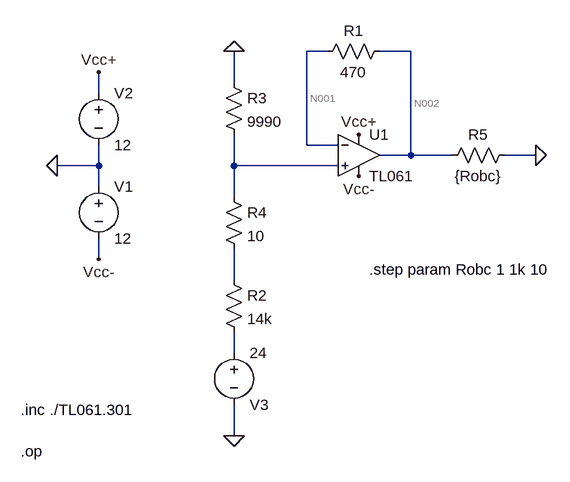
[diagram p0: schematic modul_10U_R.asc]
modul_10U_R.asc, the LTspice schematic file:
Version 4
SHEET 1 892 680
WIRE 528 -192 496 -192
WIRE 656 -192 608 -192
WIRE 384 -144 384 -192
WIRE 176 -128 176 -160
WIRE 496 -48 496 -192
WIRE 544 -48 496 -48
WIRE 656 -32 656 -192
WIRE 656 -32 608 -32
WIRE 720 -32 656 -32
WIRE 848 -32 800 -32
WIRE 176 -16 176 -48
WIRE 176 -16 112 -16
WIRE 384 -16 384 -64
WIRE 544 -16 384 -16
WIRE 176 16 176 -16
WIRE 384 32 384 -16
WIRE 176 128 176 96
WIRE 384 160 384 112
WIRE 384 272 384 240
WIRE 384 400 384 352
FLAG 112 -16 0
FLAG 176 -160 Vcc+
FLAG 176 128 Vcc-
FLAG 384 400 0
FLAG 576 -64 Vcc+
FLAG 576 0 Vcc-
FLAG 384 -192 0
FLAG 848 -32 0
SYMBOL voltage 176 0 R0
WINDOW 123 0 0 Left 0
WINDOW 39 0 0 Left 0
SYMATTR InstName V1
SYMATTR Value 12
SYMBOL voltage 176 -144 R0
WINDOW 123 0 0 Left 0
WINDOW 39 0 0 Left 0
SYMATTR InstName V2
SYMATTR Value 12
SYMBOL OpAmps\\opamp2 576 -96 R0
SYMATTR InstName U1
SYMATTR Value TL061
SYMBOL voltage 384 256 R0
WINDOW 0 24 96 Left 2
WINDOW 3 24 16 Left 2
WINDOW 123 0 0 Left 0
WINDOW 39 0 0 Left 0
SYMATTR InstName V3
SYMATTR Value 24
SYMBOL res 624 -208 R90
WINDOW 0 0 56 VBottom 2
WINDOW 3 32 56 VTop 2
SYMATTR InstName R1
SYMATTR Value 470
SYMBOL res 368 144 R0
SYMATTR InstName R2
SYMATTR Value 14k
SYMBOL res 368 -160 R0
SYMATTR InstName R3
SYMATTR Value 9990
SYMBOL res 368 16 R0
SYMATTR InstName R4
SYMATTR Value 10
SYMBOL res 816 -48 R90
WINDOW 0 0 56 VBottom 2
WINDOW 3 32 56 VTop 2
SYMATTR InstName R5
SYMATTR Value {Robc}
TEXT 56 360 Left 2 !.inc ./TL061.301
TEXT 592 144 Left 2 !.step param Robc 1 1k 10
TEXT 56 424 Left 2 !.op

The netlist it stands for:
* modul_10U_R.asc
V1 0 Vcc- 12
V2 Vcc+ 0 12
XU1 N003 N001 Vcc+ Vcc- N002 TL061  ; pins In+ In- V+ V- OUT
V3 N005 0 24
R1 N002 N001 470
R2 N004 N005 14k
R3 0 N003 9990
R4 N003 N004 10
R5 0 N002 {Robc}
.inc ./TL061.301
.step param Robc 1 1k 10
.op
.backanno
.end

* Results of the author's LTspice run, read from the files saved beside the schematic
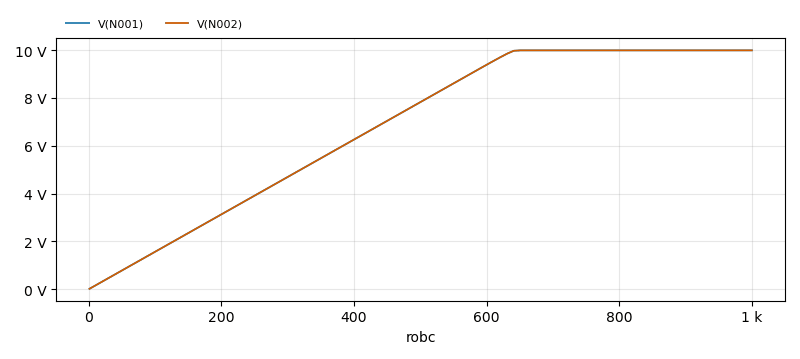
[diagram p1: Operating Point of modul_10U_R.asc, plotted from the saved traces]
* Operating Point, 1 run:
*   V(N001): 15.65 mV at robc=1 , 9.988 V at robc=1 k, min 15.65 mV, max 9.988 V
*   V(N002): 15.65 mV at robc=1 , 9.988 V at robc=1 k, min 15.65 mV, max 9.988 V
* From the log:
*   Semiconductor Device Operating Points:
*                           --- Diodes ---
*   Name:    d:u1:p      d:u1:ln     d:u1:lp     d:u1:e      d:u1:c
*   Model:    u1:dx       u1:dx       u1:dx       u1:dx       u1:dx
*   Id:     -2.40e-11   -3.06e-11    5.57e-05   -9.82e-12   -9.79e-12
*   Vd:     -2.40e+01   -3.06e+01    6.46e-01   -9.82e+00   -9.78e+00
*   Req:     1.00e+12    1.00e+12    4.65e+02    1.00e+12    1.00e+12
*   CAP:     0.00e+00    0.00e+00    0.00e+00    0.00e+00    0.00e+00
*                           --- JFET Transistors ---
*   Name:    j:u1:2      j:u1:1
*   Model:    u1:jx       u1:jx
*   Id:     -3.70e-11   -5.26e-05
*   Vgs:     1.03e+01    2.77e-01
*   Vds:    -1.17e+01   -1.12e+01
*   Gm:      0.00e+00    1.45e-04
*   Gds:     0.00e+00    0.00e+00
*   Cgs:     0.00e+00    0.00e+00
*   Cgd:     0.00e+00    0.00e+00